# Altium schematic sheet BB.GW.001.00.00 Э3 (Преобразователь частотный).SchDoc
size 840 x 594 mm; Scale: {Масш.}; Title1str: {Наименование}; PageSetup: Record=PageOptions|CenterHorizontal=False|CenterVertical=False|PrintScale=0.95|XCorrection=0.00|YCorrection=0.00|PrintKind=1|BorderSize=5000000|LeftOffset=0|BottomOffset=0|Orientation=1|PaperLength=1000|PaperWidth=1000|Scale=100|PaperSource=15|PrintQuality=600|MediaType=1|DitherType=10|PaperKind=A4|PrintScaleMode=1; Title2str: {Наименование}; ProcessInspection: {Т.контр.}; Mass: {Масса}; NormInspection: {Н.контр.}; EngineerName: {Инженер}; Letter1Column: {}; Letter2Column: {}; Letter3Column: {}; DocumentType: {Документ}; DocumentType1str: {Документ}; DocumentType2str: {Документ}; NachKonstrSekt: {Нач. КС}; NachPodrVydTz: {Рук.подр.выд.ТЗ}; NachSektNadezn: {Нач. СН}; ZamPoKonstr: {ZamPoKonstr}
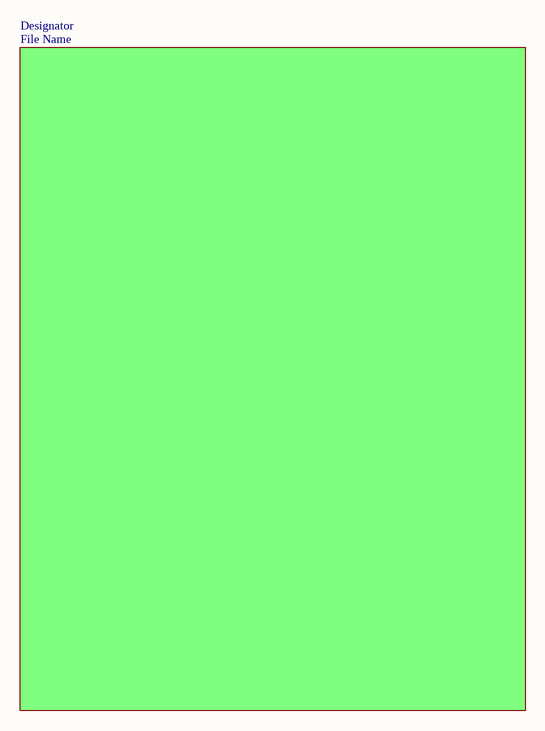
[diagram p0: BB.GW.001.00.00 Э3 (Преобразователь частотный).SchDoc]

## Sub-sheets
Designator = File Name: no entries

## Notes on the sheet
- Зам.гл.к.по констр.
- Перв. примен.
- Нач. подр. выд.ТЗ
- Справ. №
- Подп. и дата
- СН
- Инв. № дубл.
- Взам. инв. №
- Изм.
- Лист
- № докум.
- Подп.
- Дата
- Лит.
- Масса
- Масштаб
- Т.контр.
- Пров.
- Разраб.
- Листов
- Нач. КС
- Инв. № подл.
- Н.контр.
- Утв.
- Копировал
- Формат А1